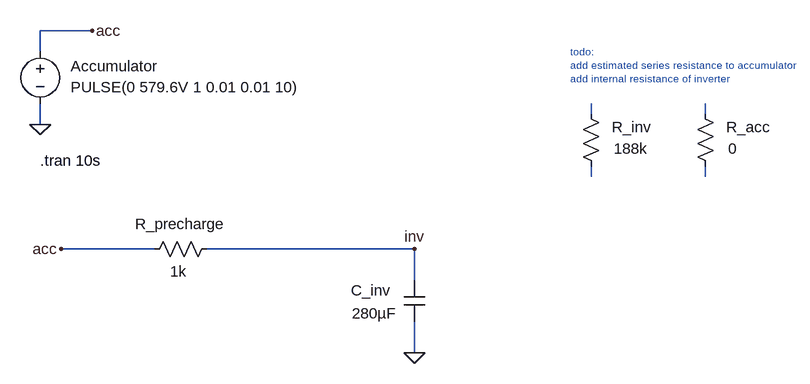
[diagram p0: schematic precharge.asc]
precharge.asc, the LTspice schematic file:
Version 4
SHEET 1 1140 708
WIRE -48 96 -128 96
WIRE -128 128 -128 96
WIRE 720 224 720 208
WIRE 896 224 896 208
WIRE -128 240 -128 208
WIRE 720 320 720 304
WIRE 896 320 896 304
WIRE 48 432 -96 432
WIRE 448 432 128 432
WIRE 448 480 448 432
WIRE 448 592 448 544
FLAG 448 592 0
FLAG -96 432 acc
FLAG 448 432 inv
FLAG -128 240 0
FLAG -48 96 acc
SYMBOL res 32 448 R270
WINDOW 0 39 56 VTop 2
WINDOW 3 -3 53 VBottom 2
SYMATTR InstName R_precharge
SYMATTR Value 1k
SYMBOL cap 432 480 R0
WINDOW 0 -82 16 Left 2
WINDOW 3 -11 51 Right 2
SYMATTR InstName C_inv
SYMATTR Value 280µF
SYMBOL res 704 208 R0
WINDOW 0 48 36 Left 2
WINDOW 3 51 69 Left 2
SYMATTR InstName R_inv
SYMATTR Value 188k
SYMBOL voltage -128 112 R0
WINDOW 0 47 38 Left 2
WINDOW 3 47 71 Left 2
WINDOW 123 0 0 Left 0
WINDOW 39 0 0 Left 0
SYMATTR InstName Accumulator
SYMATTR Value PULSE(0 579.6V 1 0.01 0.01 10)
SYMBOL res 880 208 R0
WINDOW 0 48 36 Left 2
WINDOW 3 51 69 Left 2
SYMATTR InstName R_acc
SYMATTR Value 0
TEXT 688 128 Left 1 ;todo: \nadd estimated series resistance to accumulator\nadd internal resistance of inverter
TEXT -128 296 Left 2 !.tran 10s

The netlist it stands for:
* precharge.asc
R_precharge acc inv 1k
C_inv inv 0 280µF
R_inv N001 N003 188k
V§Accumulator acc 0 PULSE(0 579.6V 1 0.01 0.01 10)
R_acc N002 N004 0
* todo:
* add estimated series resistance to accumulator
* add internal resistance of inverter
.tran 10s
.backanno
.end